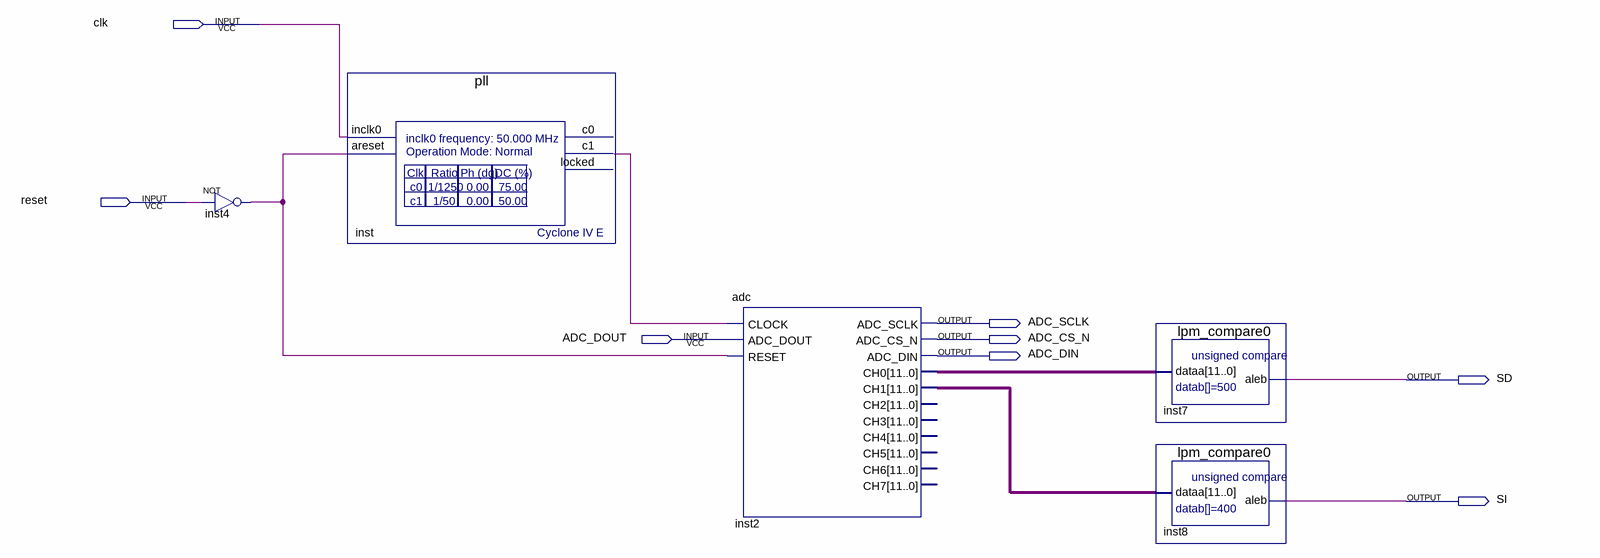
[diagram p0: schematic sheet]
// Quartus schematic laterales.bdf as structural Verilog: 5 symbols, 8 pins
module laterales (
  input  clk,
  input  reset,
  input  ADC_DOUT,
  output ADC_SCLK,
  output ADC_CS_N,
  output ADC_DIN,
  output SD,
  output SI
);

  wire inst4_out, inst_c1;
  wire [11:0] inst2_ch0, inst2_ch1;

  not inst4 (inst4_out, reset);
  pll inst (.inclk0(clk), .areset(inst4_out), .c1(inst_c1));  // open: c0, locked
  adc inst2 (
    .CLOCK(inst_c1), .ADC_DOUT(ADC_DOUT), .RESET(inst4_out), .ADC_SCLK(ADC_SCLK), .ADC_CS_N(ADC_CS_N),
    .ADC_DIN(ADC_DIN), .CH0(inst2_ch0), .CH1(inst2_ch1));  // open: CH2, CH3, CH4, CH5, CH6, CH7
  lpm_compare0 inst7 (.dataa(inst2_ch0), .aleb(SD));
  lpm_compare0 inst8 (.dataa(inst2_ch1), .aleb(SI));
endmodule
